# Altium schematic sheet MINIRACER-SD-USB.SchDoc
size A4
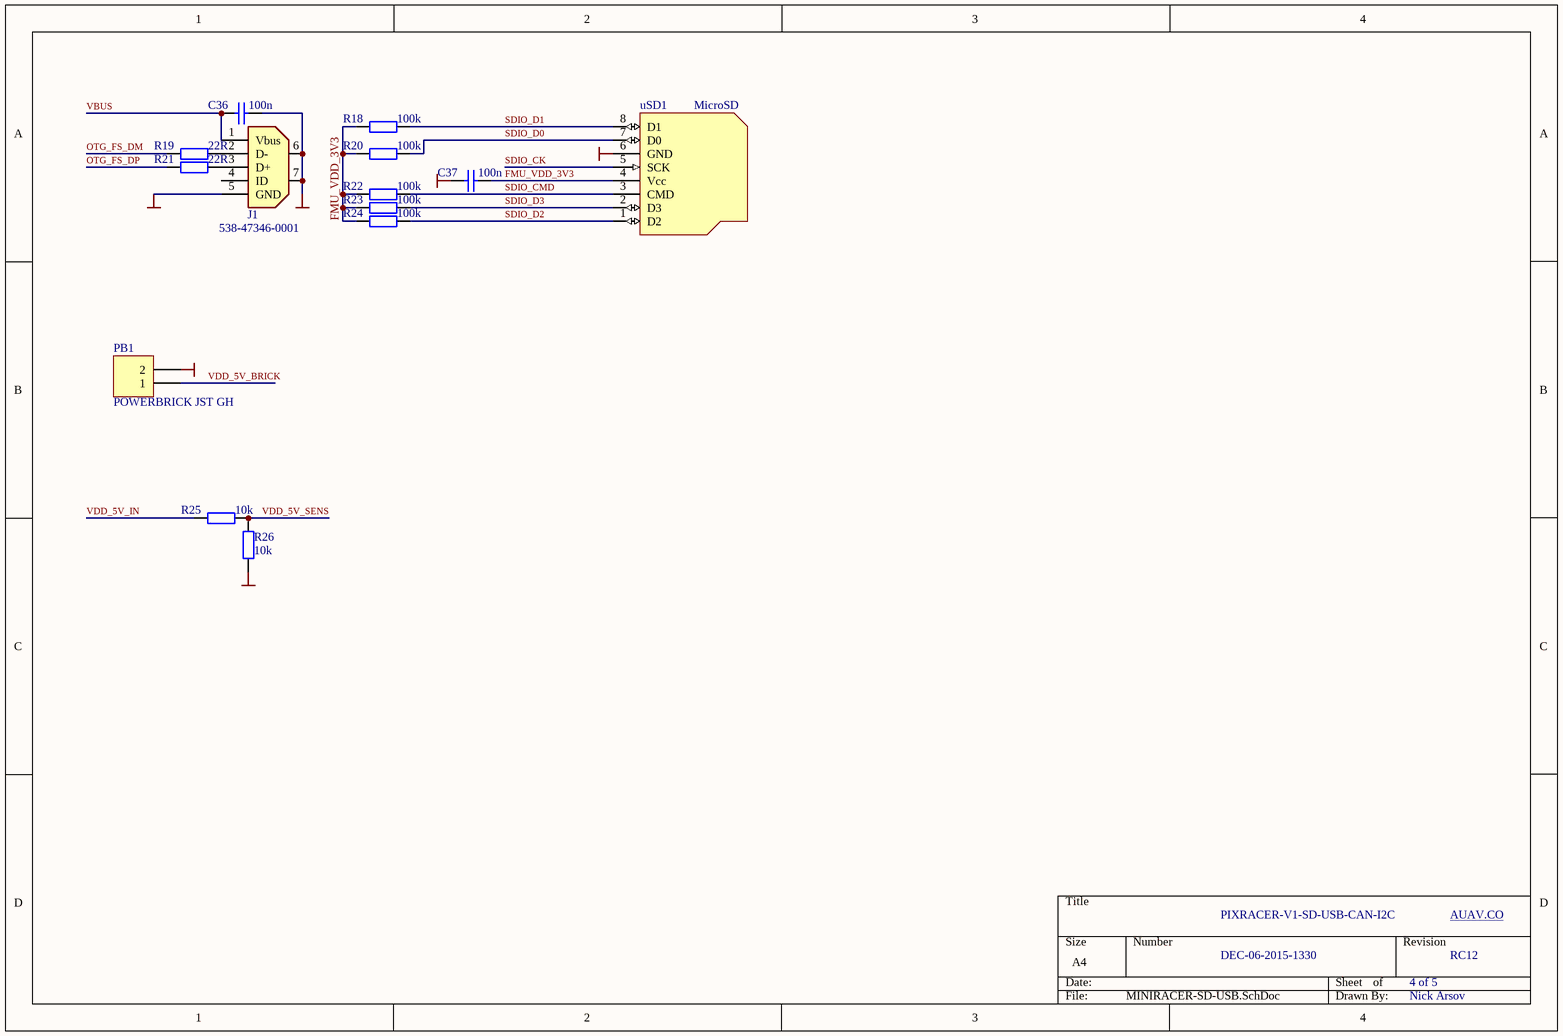
[diagram p0: MINIRACER-SD-USB.SchDoc]

## Parts
C36  100n  [0402A]
C37  100n  [0402A]
J1  Mouser Part Number: 538-47346-0001  [USBmicro_B]  (hidden comment: miniUSB)
PB1  POWERBRICK JST GH  [HDR1X2]
R18  100k  [0402A]
R19  22R  [0402A]
R20  100k  [0402A]
R21  22R  [0402A]
R22  100k  [0402A]
R23  100k  [0402A]
R24  100k  [0402A]
R25  10k  [0402A]
R26  10k  [0402A]
uSD1  MicroSD  [MicroSD_China_01]

## Nets
GND: C36.1 C37.2 J1.5(GND) J1.6(GND) J1.7(GND) PB1.2 R26.2 uSD1.6(GND)
FMU_VDD_3V3: C37.1 R18.2 R20.2 R22.2 R23.2 R24.2 uSD1.4(Vcc)
OTG_FS_DM: R19.2
OTG_FS_DP: R21.2
SDIO_CK: uSD1.5(SCK)
SDIO_CMD: R22.1 uSD1.3(CMD)
SDIO_D0: R20.1 uSD1.7(D0)
SDIO_D1: R18.1 uSD1.8(D1)
SDIO_D2: R24.1 uSD1.1(D2)
SDIO_D3: R23.1 uSD1.2(D3)
VBUS: C36.2 J1.1(Vbus)
VDD_5V_BRICK: PB1.1
VDD_5V_IN: R25.2
VDD_5V_SENS: R25.1 R26.1
NetJ1_2: J1.2(D-) R19.1
NetJ1_3: J1.3(D+) R21.1

Not connected (* = marked no-connect by the designer): J1 4(ID)

## Notes on the sheet
- PIXRACER-V1-SD-USB-CAN-I2C
- AUAV.CO
- DEC-06-2015-1330
- 4 of 5
- RC12
- Nick Arsov

## Library data of the parts
C36 C37 = Cap: Capacitor; Value: 100pF; Published: 8-Jun-2000; LatestRevisionDate: 17-Jul-2002; LatestRevisionNote: Re-released for DXP Platform.; PackageReference: RAD-0.3; Publisher: Altium Limited
J1 = MicroUSB
PB1 = Header 2: Header, 2-Pin; LatestRevisionDate: 17-Jul-2002; LatestRevisionNote: Re-released for DXP Platform.; Publisher: Altium Limited
R18-R26 = Res2: Resistor; Value: 1K; Published: 8-Jun-2000; LatestRevisionDate: 17-Jul-2002; LatestRevisionNote: Re-released for DXP Platform.; PackageReference: AXIAL-0.4; Publisher: Altium Limited; PackageDescription: Axial Device, Thru-Hole; 2 Leads; 0.4 in Pin Spacing